# EAGLE schematic midi-thru_v1 (EAGLE 9.7.0)

## Sheet 1 of 2
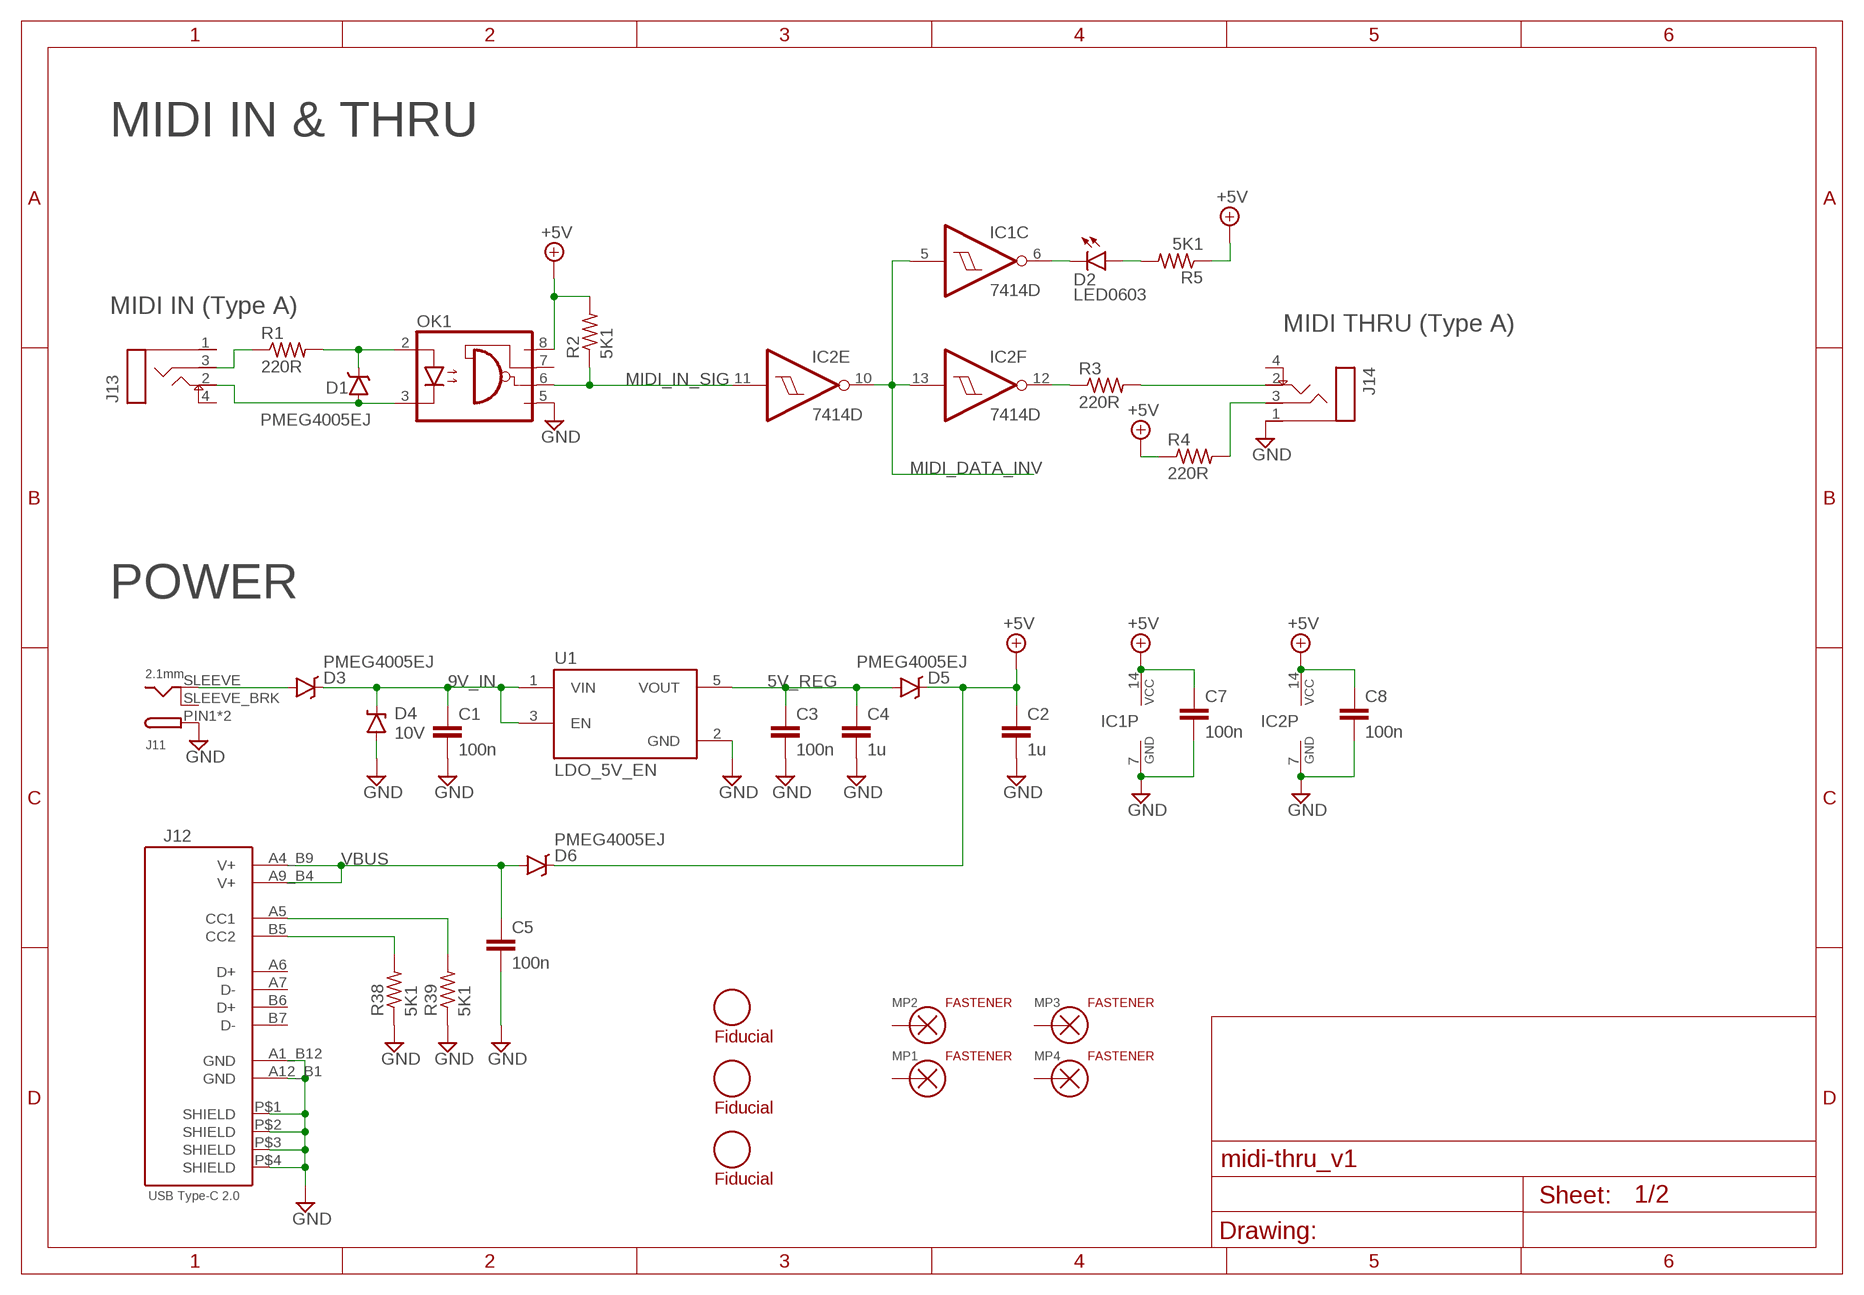
[diagram p0: schematic, sheet 1]

### Parts
C1  100n  SMD-NPC0603-100N-50V  [0603_CAP]
C2  1u  SMD-NPC0603-1U-50V  [0603_CAP]
C3  100n  SMD-NPC0603-100N-50V  [0603_CAP]
C4  1u  SMD-NPC0603-1U-50V  [0603_CAP]
C5  100n  SMD-NPC0603-100N-50V  [0603_CAP]
C7  100n  SMD-NPC0603-100N-50V  [0603_CAP]
C8  100n  SMD-NPC0603-100N-50V  [0603_CAP]
D1  PMEG4005EJ  DIODE-SCHOTTKY-PMEG4005EJ  [SOD-323]
D2  LED0603  LED0603_R  [CHIPLED_0603]
D3  PMEG4005EJ  DIODE-SCHOTTKY-PMEG4005EJ  [SOD-323]
D4  10V  DIODE-ZENER10V  [SOD-323]
D5  PMEG4005EJ  DIODE-SCHOTTKY-PMEG4005EJ  [SOD-323]
D6  PMEG4005EJ  DIODE-SCHOTTKY-PMEG4005EJ  [SOD-323]
FD1  FIDUCIALROUND_1MM  [FIDUCIAL_ROUND_1MM]
FD2  FIDUCIALROUND_1MM  [FIDUCIAL_ROUND_1MM]
FD3  FIDUCIALROUND_1MM  [FIDUCIAL_ROUND_1MM]
IC1  7414D  [SO14]
IC2  7414D  [SO14]
J11  2.1mm  DCSMT  [DCJACK_2MM_SMT]
J12  USB_TYPE-C_2.0  [12402012E212A]
J13  TRS-TIP-SW3.5MM1  [PJ-327C-4A]
J14  TRS-TIP-SW3.5MM1  [PJ-327C-4A]
MP1  SCREW-FASTENER3  [M3-PANHEAD-VIA]
MP2  SCREW-FASTENER3  [M3-PANHEAD-VIA]
MP3  SCREW-FASTENER3  [M3-PANHEAD-VIA]
MP4  SCREW-FASTENER3  [M3-PANHEAD-VIA]
OK1  6N137  6N137S  [SMD8]
R1  220R  USR0603-220R  [0603-RES]
R2  5K1  USR0603-5K1  [0603-RES]
R3  220R  USR0603-220R  [0603-RES]
R4  220R  USR0603-220R  [0603-RES]
R5  5K1  USR0603-5K1  [0603-RES]
R38  5K1  USR0603-5K1  [0603-RES]
R39  5K1  USR0603-5K1  [0603-RES]
U1  LDO_5V_EN  [SOT23-5]

### Nets
5V_REG: C3.1 C4.1 D5.A U1.5(VOUT)
9V_IN: C1.1 D3.C D4.C U1.1(VIN) U1.3(EN)
+5V: C2.1 C7.1 C8.1 D5.C D6.C IC1.14(P:VCC) IC2.14(P:VCC) OK1.8(VCC) R2.2 R4.1 R5.1 ; also sheet 2
GND: C1.2 C2.2 C3.2 C4.2 C5.2 C7.2 C8.2 D4.A IC1.7(P:GND) IC2.7(P:GND) J11.PIN1(PIN) J11.PIN2(PIN) J12.A1_B12(GND) J12.A12_B1(GND) J12.P$1(SHIELD) J12.P$2(SHIELD) J12.P$3(SHIELD) J12.P$4(SHIELD) J14.1(S) OK1.5(GND) R38.1 R39.1 U1.2(GND) ; also sheet 2
MIDI_DATA_INV: IC1.5(C:I) IC2.10(E:O) IC2.13(F:I) ; also sheet 2
MIDI_IN_SIG: IC2.11(E:I) OK1.6(VO) R2.1
N$1: J13.3(R) R1.1
N$2: D1.A J13.2(T) OK1.3(C)
N$3: D1.C OK1.2(A) R1.2
N$5: IC2.12(F:O) R3.1
N$6: J14.2(T) R3.2
N$7: J14.3(R) R4.2
N$8: D2.C IC1.6(C:O)
N$9: D2.A R5.2
N$65: D3.A J11.SLEEVE
N$66: J12.A5(CC1) R39.2
N$67: J12.B5(CC2) R38.2
VBUS: C5.1 D6.A J12.A4_B9(V+) J12.A9_B4(V+)
Unconnected: IC2.8(D:O) IC2.9(D:I) J12.A6(D+) J12.A7(D-) J12.B6(D+) J12.B7(D-) J13.1(S) J13.4(SW) J14.4(SW) MP1.P$1 MP2.P$1 MP3.P$1 MP4.P$1 OK1.7(VE)

### Notes on the sheet
- MIDI IN & THRU
- MIDI IN (Type A)
- MIDI THRU (Type A)
- POWER

## Sheet 2 of 2
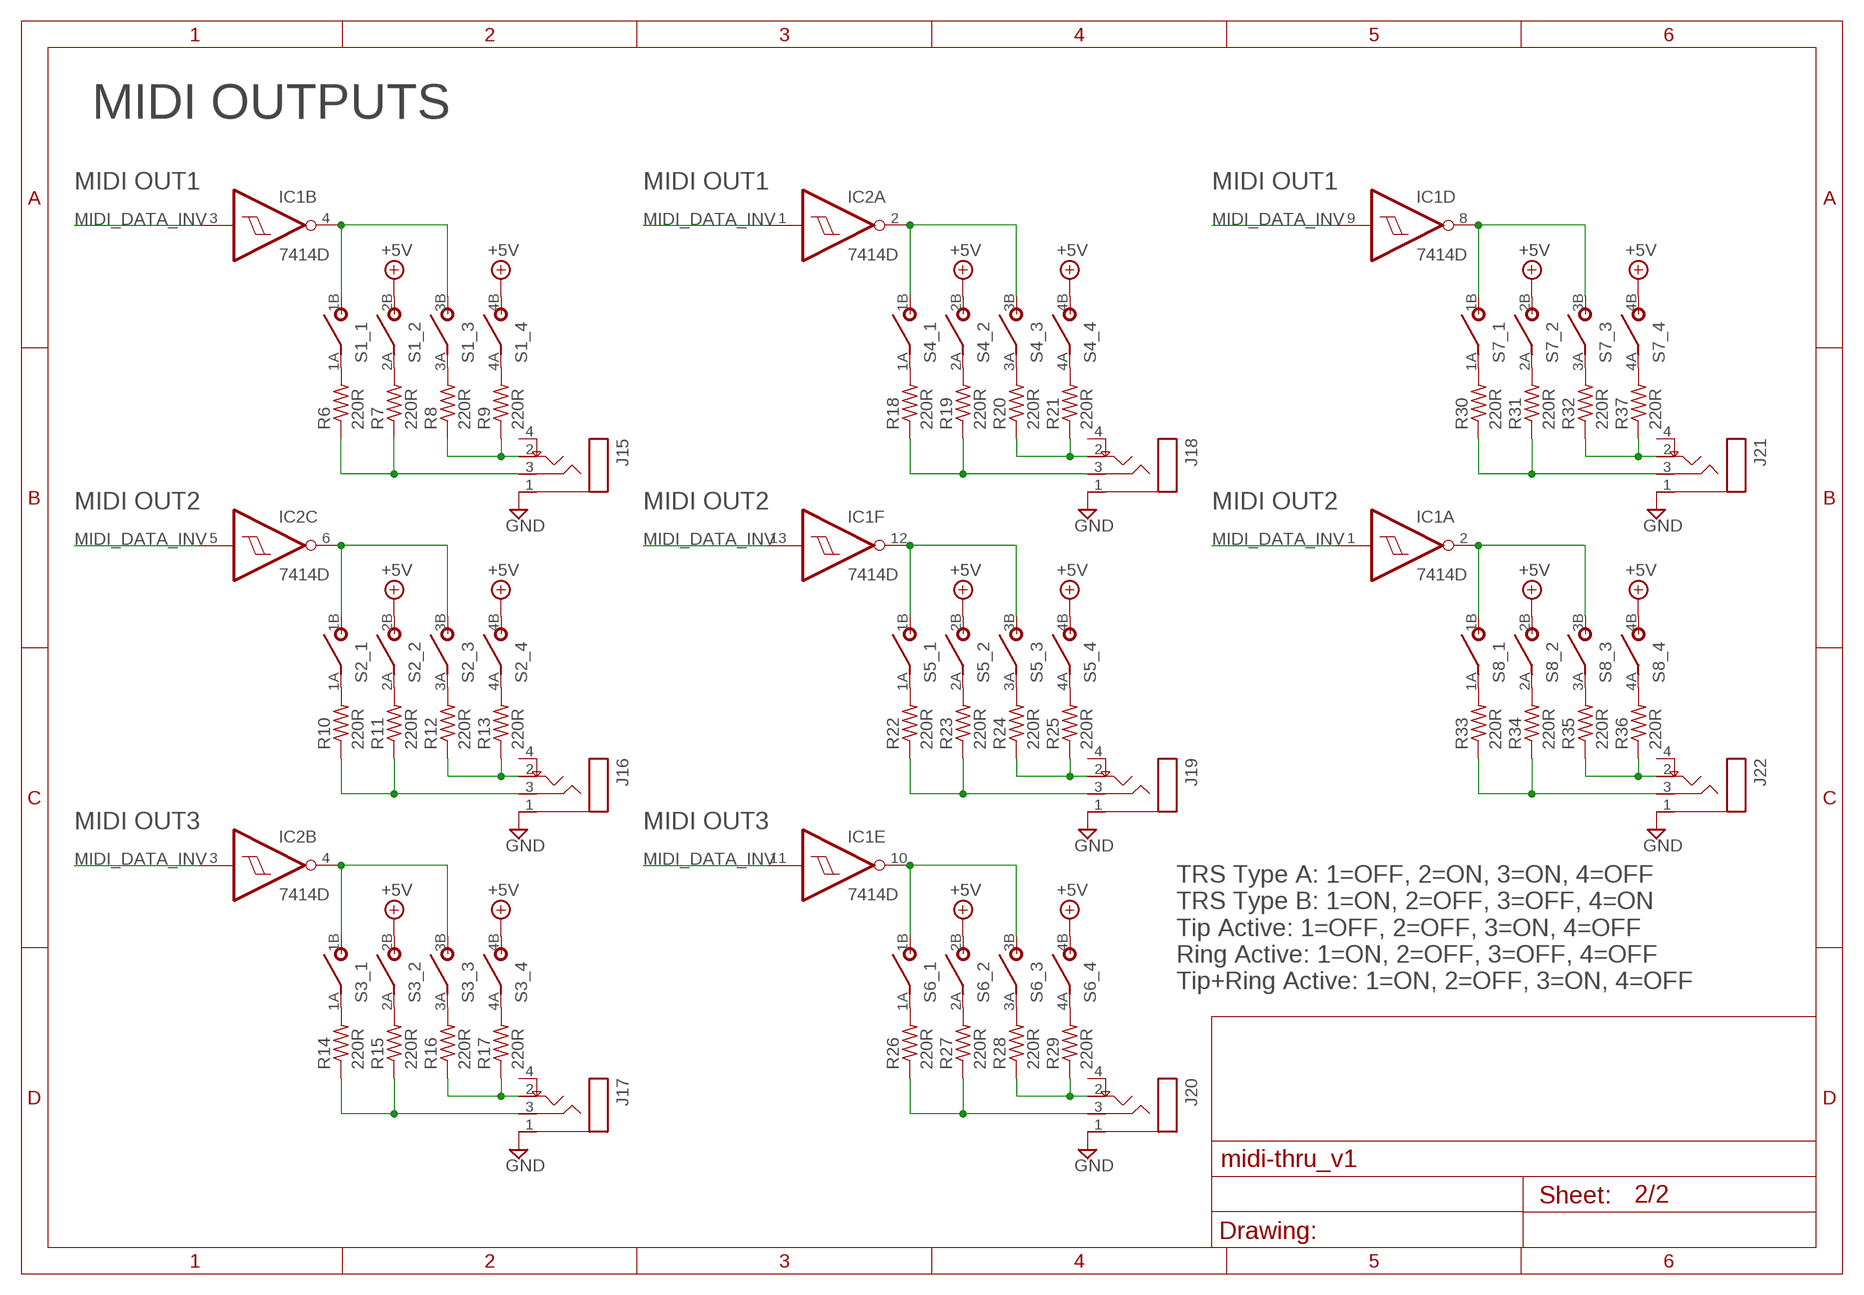
[diagram p1: schematic, sheet 2]

### Parts
J15  TRS-TIP-SW  TRS-TIP-SW3.5MM1  [PJ-327C-4A]
J16  TRS-TIP-SW  TRS-TIP-SW3.5MM1  [PJ-327C-4A]
J17  TRS-TIP-SW  TRS-TIP-SW3.5MM1  [PJ-327C-4A]
J18  TRS-TIP-SW  TRS-TIP-SW3.5MM1  [PJ-327C-4A]
J19  TRS-TIP-SW  TRS-TIP-SW3.5MM1  [PJ-327C-4A]
J20  TRS-TIP-SW3.5MM1  [PJ-327C-4A]
J21  TRS-TIP-SW3.5MM1  [PJ-327C-4A]
J22  TRS-TIP-SW  TRS-TIP-SW3.5MM1  [PJ-327C-4A]
R6  220R  USR0603-220R  [0603-RES]
R7  220R  USR0603-220R  [0603-RES]
R8  220R  USR0603-220R  [0603-RES]
R9  220R  USR0603-220R  [0603-RES]
R10  220R  USR0603-220R  [0603-RES]
R11  220R  USR0603-220R  [0603-RES]
R12  220R  USR0603-220R  [0603-RES]
R13  220R  USR0603-220R  [0603-RES]
R14  220R  USR0603-220R  [0603-RES]
R15  220R  USR0603-220R  [0603-RES]
R16  220R  USR0603-220R  [0603-RES]
R17  220R  USR0603-220R  [0603-RES]
R18  220R  USR0603-220R  [0603-RES]
R19  220R  USR0603-220R  [0603-RES]
R20  220R  USR0603-220R  [0603-RES]
R21  220R  USR0603-220R  [0603-RES]
R22  220R  USR0603-220R  [0603-RES]
R23  220R  USR0603-220R  [0603-RES]
R24  220R  USR0603-220R  [0603-RES]
R25  220R  USR0603-220R  [0603-RES]
R26  220R  USR0603-220R  [0603-RES]
R27  220R  USR0603-220R  [0603-RES]
R28  220R  USR0603-220R  [0603-RES]
R29  220R  USR0603-220R  [0603-RES]
R30  220R  USR0603-220R  [0603-RES]
R31  220R  USR0603-220R  [0603-RES]
R32  220R  USR0603-220R  [0603-RES]
R33  220R  USR0603-220R  [0603-RES]
R34  220R  USR0603-220R  [0603-RES]
R35  220R  USR0603-220R  [0603-RES]
R36  220R  USR0603-220R  [0603-RES]
R37  220R  USR0603-220R  [0603-RES]
S1  DIPSW_4SMD  [DIP4_2.54]
S2  DIPSW_4SMD  [DIP4_2.54]
S3  DIPSW_4SMD  [DIP4_2.54]
S4  DIPSW_4SMD  [DIP4_2.54]
S5  DIPSW_4SMD  [DIP4_2.54]
S6  DIPSW_4SMD  [DIP4_2.54]
S7  DIPSW_4SMD  [DIP4_2.54]
S8  DIPSW_4SMD  [DIP4_2.54]

### Nets
+5V: S1.2B(_2:S) S1.4B(_4:S) S2.2B(_2:S) S2.4B(_4:S) S3.2B(_2:S) S3.4B(_4:S) S4.2B(_2:S) S4.4B(_4:S) S5.2B(_2:S) S5.4B(_4:S) S6.2B(_2:S) S6.4B(_4:S) S7.2B(_2:S) S7.4B(_4:S) S8.2B(_2:S) S8.4B(_4:S) ; also sheet 1
GND: J15.1(S) J16.1(S) J17.1(S) J18.1(S) J19.1(S) J20.1(S) J21.1(S) J22.1(S) ; also sheet 1
MIDI_DATA_INV: IC1.1(A:I) IC1.3(B:I) IC1.9(D:I) IC1.11(E:I) IC1.13(F:I) IC2.1(A:I) IC2.3(B:I) IC2.5(C:I) ; also sheet 1
N$4: J16.3(R) R10.1 R11.1
N$10: J15.3(R) R6.1 R7.1
N$11: R6.2 S1.1A(_1:P)
N$12: R7.2 S1.2A(_2:P)
N$13: J15.2(T) R8.1 R9.1
N$14: R8.2 S1.3A(_3:P)
N$15: R9.2 S1.4A(_4:P)
N$16: IC1.4(B:O) S1.1B(_1:S) S1.3B(_3:S)
N$17: J16.2(T) R12.1 R13.1
N$18: R10.2 S2.1A(_1:P)
N$19: R11.2 S2.2A(_2:P)
N$20: R12.2 S2.3A(_3:P)
N$21: R13.2 S2.4A(_4:P)
N$22: IC2.6(C:O) S2.1B(_1:S) S2.3B(_3:S)
N$23: J17.3(R) R14.1 R15.1
N$24: J17.2(T) R16.1 R17.1
N$25: IC2.4(B:O) S3.1B(_1:S) S3.3B(_3:S)
N$26: R14.2 S3.1A(_1:P)
N$27: R15.2 S3.2A(_2:P)
N$28: R16.2 S3.3A(_3:P)
N$29: R17.2 S3.4A(_4:P)
N$30: J18.3(R) R18.1 R19.1
N$31: J18.2(T) R20.1 R21.1
N$32: R18.2 S4.1A(_1:P)
N$33: R19.2 S4.2A(_2:P)
N$34: R20.2 S4.3A(_3:P)
N$35: R21.2 S4.4A(_4:P)
N$36: IC2.2(A:O) S4.1B(_1:S) S4.3B(_3:S)
N$37: J19.3(R) R22.1 R23.1
N$38: J19.2(T) R24.1 R25.1
N$39: R22.2 S5.1A(_1:P)
N$40: R23.2 S5.2A(_2:P)
N$41: R24.2 S5.3A(_3:P)
N$42: R25.2 S5.4A(_4:P)
N$43: IC1.12(F:O) S5.1B(_1:S) S5.3B(_3:S)
N$44: J20.3(R) R26.1 R27.1
N$45: J20.2(T) R28.1 R29.1
N$46: IC1.10(E:O) S6.1B(_1:S) S6.3B(_3:S)
N$47: R26.2 S6.1A(_1:P)
N$48: R27.2 S6.2A(_2:P)
N$49: R28.2 S6.3A(_3:P)
N$50: R29.2 S6.4A(_4:P)
N$51: J21.3(R) R30.1 R31.1
N$52: J21.2(T) R32.1 R37.1
N$53: IC1.8(D:O) S7.1B(_1:S) S7.3B(_3:S)
N$54: J22.3(R) R33.1 R34.1
N$55: J22.2(T) R35.1 R36.1
N$56: IC1.2(A:O) S8.1B(_1:S) S8.3B(_3:S)
N$57: R30.2 S7.1A(_1:P)
N$58: R31.2 S7.2A(_2:P)
N$59: R32.2 S7.3A(_3:P)
N$60: R33.2 S8.1A(_1:P)
N$61: R34.2 S8.2A(_2:P)
N$62: R35.2 S8.3A(_3:P)
N$63: R36.2 S8.4A(_4:P)
N$64: R37.2 S7.4A(_4:P)
Unconnected: J15.4(SW) J16.4(SW) J17.4(SW) J18.4(SW) J19.4(SW) J20.4(SW) J21.4(SW) J22.4(SW)

### Notes on the sheet
- MIDI OUTPUTS
- MIDI OUT1 | MIDI OUT1 | MIDI OUT1
- MIDI OUT2 | MIDI OUT2 | MIDI OUT2
- MIDI OUT3 | MIDI OUT3
- TRS Type A: 1=OFF, 2=ON, 3=ON, 4=OFF
  TRS Type B: 1=ON, 2=OFF, 3=OFF, 4=ON
  Tip Active: 1=OFF, 2=OFF, 3=ON, 4=OFF
  Ring Active: 1=ON, 2=OFF, 3=OFF, 4=OFF
  Tip+Ring Active: 1=ON, 2=OFF, 3=ON, 4=OFF

## Power pins joined to a net without a drawn wire
CONNECT: J11.SLEEVE_BRK(CONNECT)

## Library data of the parts
C1 C3 C5 C7 C8 = SPENCER Capacitors:SMD-NP: General usage non-polarized capacitors. House parts are denoted with suffic 'H'.; DIELECTRIC: X7R; MANUFACTURER: YAGEO; PART_NO: C0603-100NF-50V; SUPPLIER: MOUSER; TOLERANCE: 10%; VOLTAGE: 50V
C2 C4 = SPENCER Capacitors:SMD-NP: General usage non-polarized capacitors. House parts are denoted with suffic 'H'.; DIELECTRIC: X5R; MANUFACTURER: YAGEO; PART_NO: C0603-1UF-50V; SUPPLIER: MOUSER; TOLERANCE: 10%; VOLTAGE: 50V
D1 D3 D5 D6 = SPENCER. diodes:DIODE-SCHOTTKY: Schottky diodes in SFE's production catalog BAT20J 1A 23V 0.62Vf RB751 120mA 40V 0.37Vf PMEG4005EJ 0.5A 40V 0.42Vf MBRA140 1A 40V 0.5Vf B340A 3A 40V SMA; MPN: PMEG4005EJ; PART_NO: SOD323-SCHOTTKY-1A; SUPPLIER: MOUSER
D2 = SPENCER. diodes:LED; PART_NO: LED-0603-RED
D4 = SPENCER. diodes:DIODE-ZENER: Zener Diode Production Part - 8199 3.4V Zener Voltage; PART_NO: MM3Z10VST1G; SUPPLIER: MOUSER
FD1-FD3 = SPENCER miscellaneous:FIDUCIAL
IC1 IC2 = SPENCER. ics:74*14: Hex schmitt trigger INVERTER; MPN: 74HC14M/TR; PART_NO: 74HC14-SOIC-14
J11 = SPENCER Connectors:DC: DC Jack; MANUFACTURER: TENSILITY INTERNATIONAL CORP; MPN: 54-00164; PART_NO: DC-2.1-SMD; SUPPLIER: DIGIKEY
J12 = SPENCER Connectors:USB_TYPE-C_2.0: JAE DX07S024JJ2 USB Type-C Connector ***Footprint contains plated drill holes (2mm diameter) instead of plated slots (easier on fabhouse)*** Technical Specifications: Mating cycles: 10,000 times Contact resistance: 40mΩ (max.) Rated current: 1.25A (max.) on pins A1, A4, A9, A12, B1, B4, B5, B9 and B12 0.25A (max.) on others Rated voltage: 20Vrms Datasheet <https://www.jae.com/z-en/pdf_download_exec.cfm?param=MB-0297-3E_DX07.pdf> Digi-Key part #: 670-2794-6-ND <http://www.digikey.com/product-detail/en/jae-electronics/DX07S024JJ2R1300/670-2794-6-ND/5246069> Mouser part #: 656-DX07S024JJ2R1300 <http://ca.mouser.com/ProductDetail/JAE-Electronics/DX07S024JJ2R1300/?qs=%2fha2pyFaduhsAyGD7ZqdDeHjVi4g0c8wrw%252bV08Os%252brQ5DqW1EY3Lew%3d%3d> Manufacturer part #: DX07S024JJ2R1300; MANUFACTURER: AMPHENOL; MPN: 12402012E212A; PART_NO: USBC-2.0; SUPPLIER: MOUSER
J13-J22 = SPENCER Connectors:TRS-TIP-SW; MPN: PJ-327C-4A; PART_NO: PJ-327C-4A
MP1-MP4 = SPENCER miscellaneous:SCREW-FASTENER
OK1 = SPENCER. ics:6N137: MOTOROLA OPTO COUPLER; MANUFACTURER: LITE-ON; MPN: 6N137S; PART_NO: 6N137-SMD; SUPPLIER: MOUSER
R1 R3 R4 R6-R37 = SPENCER. resistors:US: Standard resistor package for most 1/4W (6mm) resistors. Suitable for both carbon and metal film type resistors. Package layouts vary between 1-6 0.1" hole spacings.; MANUFACTURER: YAGEO; PART_NO: R0603-220R; SUPPLIER: MOUSER
R2 R5 R38 R39 = SPENCER. resistors:US: Standard resistor package for most 1/4W (6mm) resistors. Suitable for both carbon and metal film type resistors. Package layouts vary between 1-6 0.1" hole spacings.; MANUFACTURER: YAGEO; PART_NO: R0603-5K1; SUPPLIER: MOUSER
S1-S8 = SPENCER. Switches:DIPSW_4: Small compact SPST switches in a Dual In-Line (DIP) package. Useful for digital inputs, or adjusting individual circuit elements.; MANUFACTURER: CUI; MPN: DS04-254-2-04BK-SMT; PART_NO: DIP4-2.54-SMD
U1 = SPENCER. regulators converters:LDO_5V_EN: Linear Voltage Regulator IC 1 Output 300mA SOT-23-5 Check prices <https://pricing.snapeda.com/parts/MIC5504-3.3YM5%20TR/Microchip/view-part?ref=eda>; DESCRIPTION: 5V 150 mA Fixed Surface Mount Voltage Regulator - SOT-23; MANUFACTUER: Max Linear; MPN: SPX5205M5-L-5-0/TR; PACKAGE: SOT-23-5; PART_NO: LDO-SOT23-5V